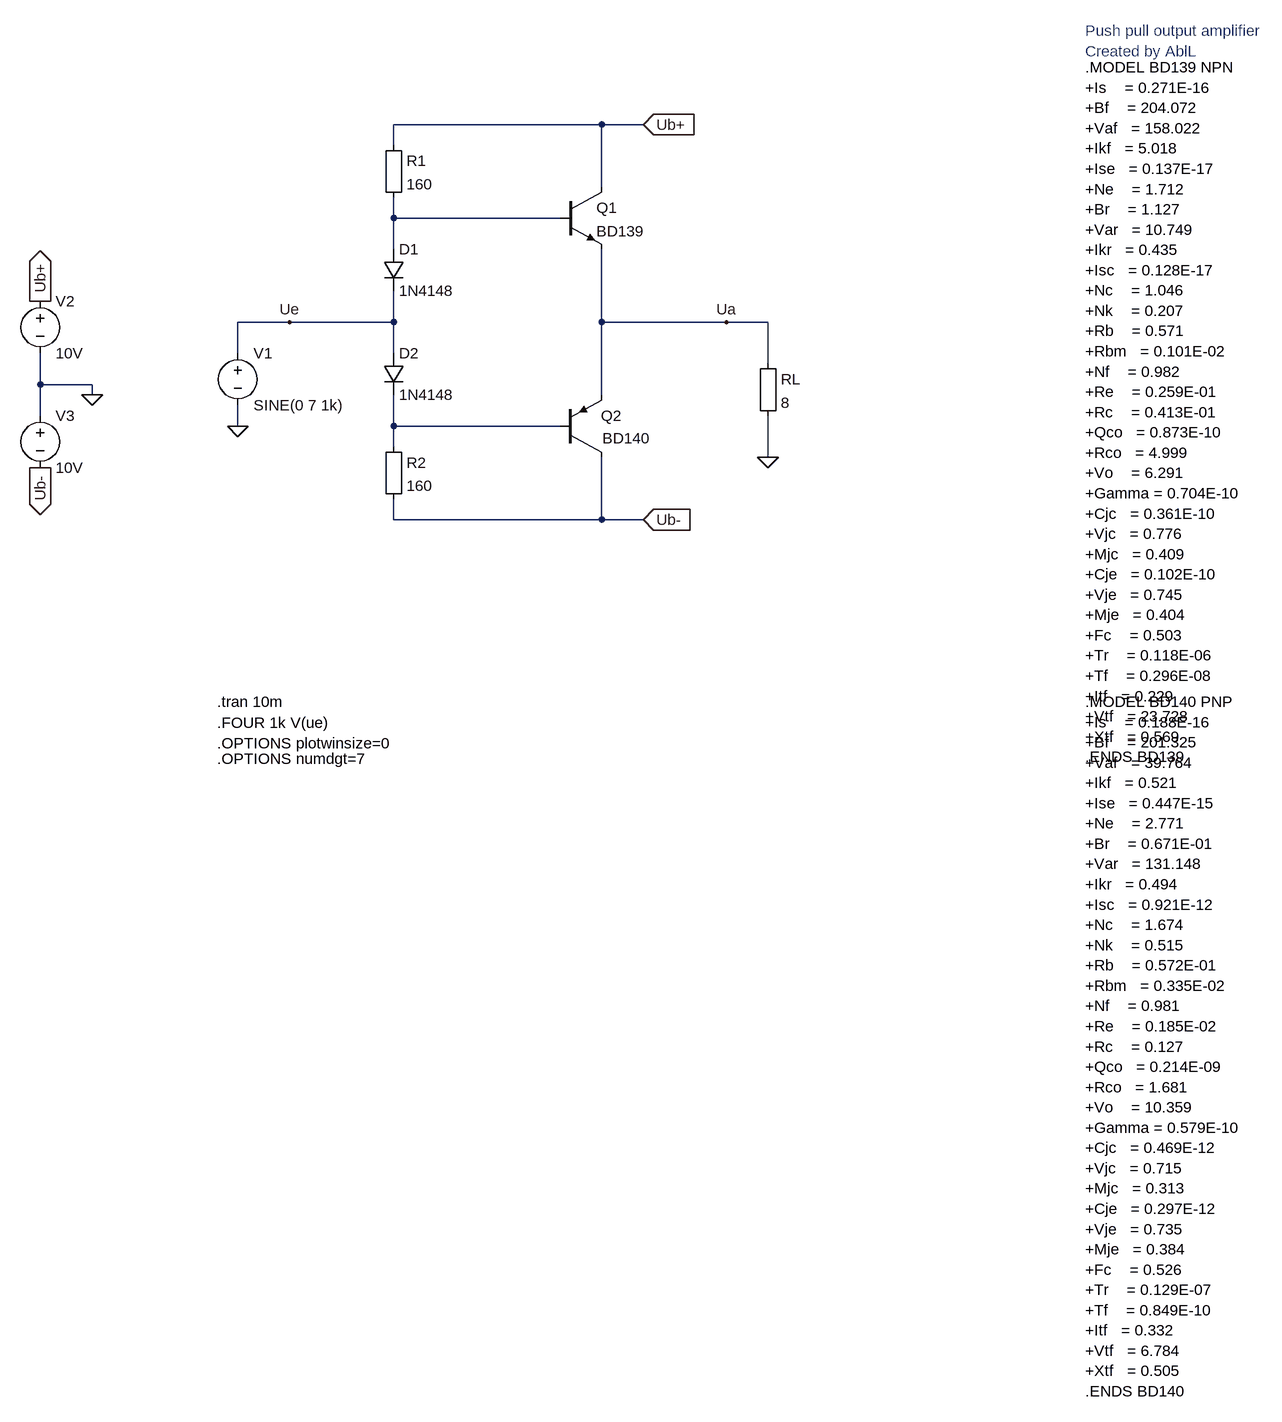
[diagram p0: schematic Gegentaktendstufe.asc]
Gegentaktendstufe.asc, the LTspice schematic file:
Version 4
SHEET 1 1496 1856
WIRE 448 0 128 0
WIRE 512 0 448 0
WIRE 128 32 128 0
WIRE 448 96 448 0
WIRE 128 144 128 112
WIRE 384 144 128 144
WIRE 128 192 128 144
WIRE -32 304 -112 304
WIRE 128 304 128 256
WIRE 128 304 -32 304
WIRE 448 304 448 192
WIRE 640 304 448 304
WIRE 704 304 640 304
WIRE -112 352 -112 304
WIRE 128 352 128 304
WIRE 704 368 704 304
WIRE -416 400 -416 352
WIRE -336 400 -416 400
WIRE -336 416 -336 400
WIRE 448 416 448 304
WIRE -416 448 -416 400
WIRE -112 464 -112 432
WIRE 128 464 128 416
WIRE 384 464 128 464
WIRE 128 496 128 464
WIRE 704 512 704 448
WIRE 128 608 128 576
WIRE 448 608 448 512
WIRE 448 608 128 608
WIRE 512 608 448 608
FLAG 512 0 Ub+
IOPIN 512 0 In
FLAG 512 608 Ub-
IOPIN 512 608 In
FLAG -32 304 Ue
FLAG 640 304 Ua
FLAG -112 464 0
FLAG 704 512 0
FLAG -336 416 0
FLAG -416 272 Ub+
IOPIN -416 272 Out
FLAG -416 528 Ub-
IOPIN -416 528 Out
SYMBOL Misc\\EuropeanResistor 112 16 R0
SYMATTR InstName R1
SYMATTR Value 160
SYMBOL Misc\\EuropeanResistor 112 480 R0
SYMATTR InstName R2
SYMATTR Value 160
SYMBOL diode 112 192 R0
SYMATTR InstName D1
SYMATTR Value 1N4148
SYMBOL diode 112 352 R0
SYMATTR InstName D2
SYMATTR Value 1N4148
SYMBOL Misc\\EuropeanResistor 688 352 R0
SYMATTR InstName RL
SYMATTR Value 8
SYMBOL npn 384 96 R0
SYMATTR InstName Q1
SYMATTR Value BD139
SYMBOL pnp 384 512 M180
WINDOW 0 63 64 Left 2
WINDOW 3 65 29 Left 2
SYMATTR InstName Q2
SYMATTR Value BD140
SYMBOL voltage -112 336 R0
WINDOW 123 0 0 Left 0
WINDOW 39 0 0 Left 0
SYMATTR InstName V1
SYMATTR Value SINE(0 7 1k)
SYMBOL voltage -416 256 R0
WINDOW 123 0 0 Left 0
WINDOW 39 0 0 Left 0
SYMATTR InstName V2
SYMATTR Value 10V
SYMBOL voltage -416 432 R0
WINDOW 123 0 0 Left 0
WINDOW 39 0 0 Left 0
SYMATTR InstName V3
SYMATTR Value 10V
TEXT 1192 -88 Left 2 !.MODEL BD139 NPN\n+Is    = 0.271E-16\n+Bf    = 204.072\n+Vaf   = 158.022\n+Ikf   = 5.018\n+Ise   = 0.137E-17\n+Ne    = 1.712\n+Br    = 1.127\n+Var   = 10.749\n+Ikr   = 0.435\n+Isc   = 0.128E-17\n+Nc    = 1.046\n+Nk    = 0.207\n+Rb    = 0.571\n+Rbm   = 0.101E-02\n+Nf    = 0.982\n+Re    = 0.259E-01\n+Rc    = 0.413E-01\n+Qco   = 0.873E-10\n+Rco   = 4.999\n+Vo    = 6.291\n+Gamma = 0.704E-10\n+Cjc   = 0.361E-10\n+Vjc   = 0.776\n+Mjc   = 0.409\n+Cje   = 0.102E-10\n+Vje   = 0.745\n+Mje   = 0.404\n+Fc    = 0.503\n+Tr    = 0.118E-06\n+Tf    = 0.296E-08\n+Itf   = 0.229\n+Vtf   = 23.728\n+Xtf   = 0.569\n.ENDS BD139
TEXT -144 888 Left 2 !.tran 10m
TEXT 1192 888 Left 2 !.MODEL BD140 PNP\n+Is    = 0.188E-16\n+Bf    = 201.325\n+Vaf   = 39.764\n+Ikf   = 0.521\n+Ise   = 0.447E-15\n+Ne    = 2.771\n+Br    = 0.671E-01\n+Var   = 131.148\n+Ikr   = 0.494\n+Isc   = 0.921E-12\n+Nc    = 1.674\n+Nk    = 0.515\n+Rb    = 0.572E-01\n+Rbm   = 0.335E-02\n+Nf    = 0.981\n+Re    = 0.185E-02\n+Rc    = 0.127\n+Qco   = 0.214E-09\n+Rco   = 1.681\n+Vo    = 10.359\n+Gamma = 0.579E-10\n+Cjc   = 0.469E-12\n+Vjc   = 0.715\n+Mjc   = 0.313\n+Cje   = 0.297E-12\n+Vje   = 0.735\n+Mje   = 0.384\n+Fc    = 0.526\n+Tr    = 0.129E-07\n+Tf    = 0.849E-10\n+Itf   = 0.332\n+Vtf   = 6.784\n+Xtf   = 0.505\n.ENDS BD140
TEXT -144 920 Left 2 !.FOUR 1k V(ue)
TEXT -144 952 Left 2 !.OPTIONS plotwinsize=0
TEXT -144 976 Left 2 !.OPTIONS numdgt=7
TEXT 1192 -144 Left 2 ;Push pull output amplifier\nCreated by AblL

The netlist it stands for:
* Gegentaktendstufe.asc
R1 Ub+ N001 160
R2 N002 Ub- 160
D1 N001 Ue 1N4148
D2 Ue N002 1N4148
RL Ua 0 8
Q1 Ub+ N001 Ua 0 BD139
Q2 Ub- N002 Ua 0 BD140
V1 Ue 0 SINE(0 7 1k)
V2 Ub+ 0 10V
V3 0 Ub- 10V
.model D D
.lib standard.dio
.model NPN NPN
.model PNP PNP
.lib standard.bjt
.MODEL BD139 NPN
+Is    = 0.271E-16
+Bf    = 204.072
+Vaf   = 158.022
+Ikf   = 5.018
+Ise   = 0.137E-17
+Ne    = 1.712
+Br    = 1.127
+Var   = 10.749
+Ikr   = 0.435
+Isc   = 0.128E-17
+Nc    = 1.046
+Nk    = 0.207
+Rb    = 0.571
+Rbm   = 0.101E-02
+Nf    = 0.982
+Re    = 0.259E-01
+Rc    = 0.413E-01
+Qco   = 0.873E-10
+Rco   = 4.999
+Vo    = 6.291
+Gamma = 0.704E-10
+Cjc   = 0.361E-10
+Vjc   = 0.776
+Mjc   = 0.409
+Cje   = 0.102E-10
+Vje   = 0.745
+Mje   = 0.404
+Fc    = 0.503
+Tr    = 0.118E-06
+Tf    = 0.296E-08
+Itf   = 0.229
+Vtf   = 23.728
+Xtf   = 0.569
.ENDS BD139
.tran 10m
.MODEL BD140 PNP
+Is    = 0.188E-16
+Bf    = 201.325
+Vaf   = 39.764
+Ikf   = 0.521
+Ise   = 0.447E-15
+Ne    = 2.771
+Br    = 0.671E-01
+Var   = 131.148
+Ikr   = 0.494
+Isc   = 0.921E-12
+Nc    = 1.674
+Nk    = 0.515
+Rb    = 0.572E-01
+Rbm   = 0.335E-02
+Nf    = 0.981
+Re    = 0.185E-02
+Rc    = 0.127
+Qco   = 0.214E-09
+Rco   = 1.681
+Vo    = 10.359
+Gamma = 0.579E-10
+Cjc   = 0.469E-12
+Vjc   = 0.715
+Mjc   = 0.313
+Cje   = 0.297E-12
+Vje   = 0.735
+Mje   = 0.384
+Fc    = 0.526
+Tr    = 0.129E-07
+Tf    = 0.849E-10
+Itf   = 0.332
+Vtf   = 6.784
+Xtf   = 0.505
.ENDS BD140
.FOUR 1k V(ue)
.OPTIONS plotwinsize=0
.OPTIONS numdgt=7
* Push pull output amplifier
* Created by AblL
.backanno
.end